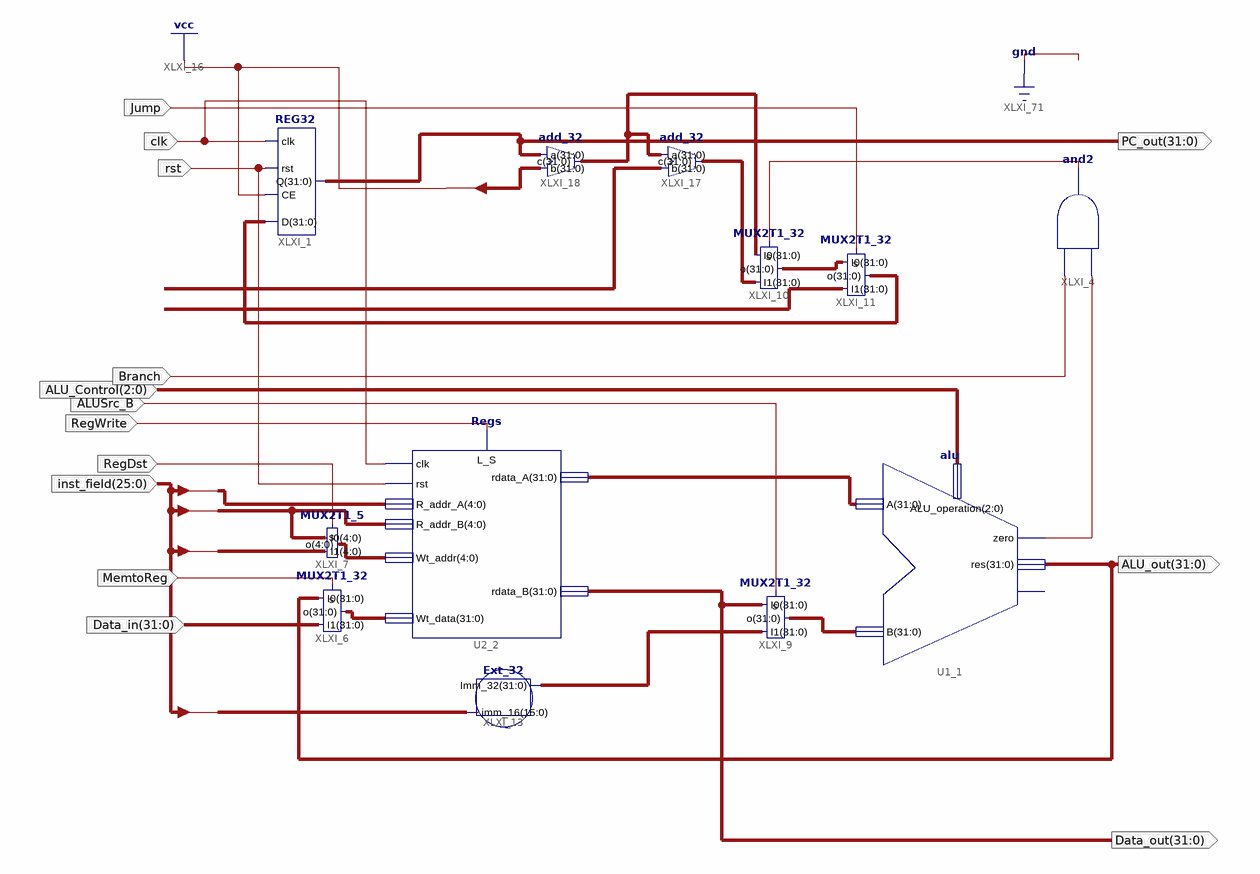
[diagram p0: schematic sheet 1]
// Xilinx ISE schematic Data_path.sch (kintex7) as structural Verilog: 12 symbols, 14 ports
module Data_path (
  input  [25:0] inst_field,
  input  RegDst,
  input  clk,
  input  MemtoReg,
  input  [31:0] Data_in,
  input  Branch,
  input  [2:0] ALU_Control,
  input  Jump,
  input  rst,
  input  RegWrite,
  input  ALUSrc_B,
  output [31:0] Data_out,
  output [31:0] ALU_out,
  output [31:0] PC_out
);

  wire XLXN_24, XLXN_31;
  wire [4:0] XLXN_43;
  wire [31:0] branch_addr, Imm_32, pc_4, XLXN_9, XLXN_22, XLXN_37, XLXN_39, XLXN_41;

  MUX2T1_5 XLXI_7 (.I1(inst_field[15:11]), .I0(inst_field[20:16]), .o(XLXN_43), .s(RegDst));
  and XLXI_4 (XLXN_24, XLXN_31, Branch);
  Regs U2_2 (
    .clk(clk), .L_S(RegWrite), .rdata_A(XLXN_39), .rst(rst), .Wt_data(XLXN_41), .rdata_B(Data_out),
    .R_addr_A(inst_field[25:21]), .R_addr_B(inst_field[20:16]), .Wt_addr(XLXN_43));
  alu U1_1 (.zero(XLXN_31), .res(ALU_out), .A(XLXN_39), .B(XLXN_37), .ALU_operation(ALU_Control));  // open: overflow
  add_32 XLXI_17 (.c(branch_addr), .a(pc_4), .b({Imm_32[29:0], 2'b00}));
  add_32 XLXI_18 (.c(pc_4), .a(PC_out), .b(32'b00000000000000000000000000000100));
  MUX2T1_32 XLXI_10 (.s(XLXN_24), .I0(pc_4), .I1(branch_addr), .o(XLXN_9));
  MUX2T1_32 XLXI_11 (.s(Jump), .I0(XLXN_9), .I1({pc_4[31:28], inst_field, 2'b00}), .o(XLXN_22));
  Ext_32 XLXI_13 (.imm_16(inst_field[15:0]), .Imm_32(Imm_32));
  MUX2T1_32 XLXI_9 (.s(ALUSrc_B), .I0(Data_out), .I1(Imm_32), .o(XLXN_37));
  MUX2T1_32 XLXI_6 (.s(MemtoReg), .I0(ALU_out), .I1(Data_in), .o(XLXN_41));
  REG32 XLXI_1 (.D(XLXN_22), .CE(1'b1), .rst(rst), .clk(clk), .Q(PC_out));
endmodule
